# Altium schematic sheet ScaledModelBoard.SchDoc
size A; SheetNumber: 1; SheetTotal: 1
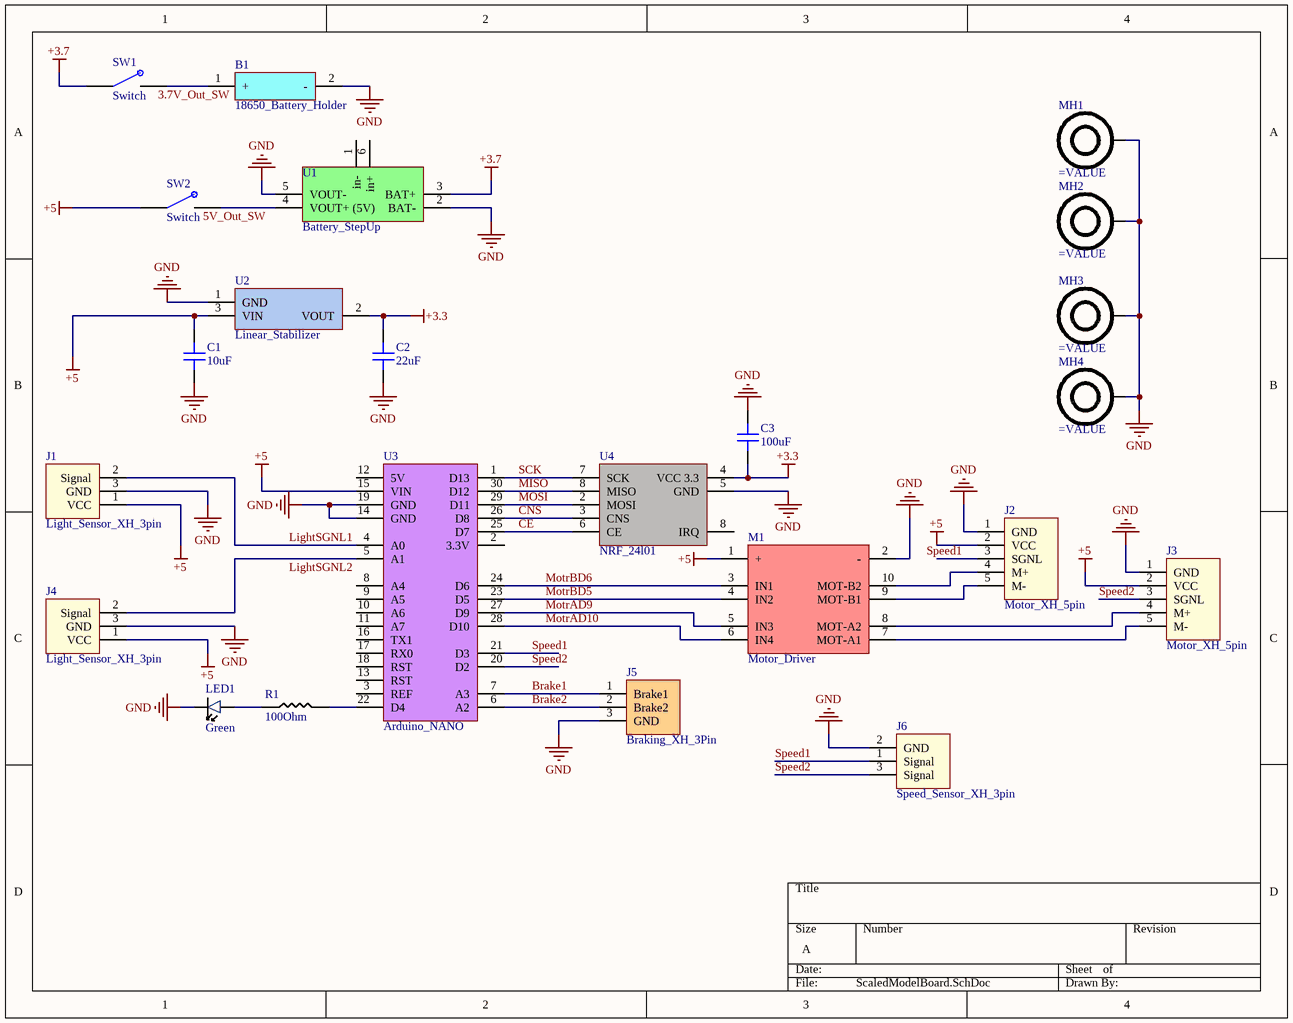
[diagram p0: ScaledModelBoard.SchDoc]

## Parts
B1  18650_Battery_Holder  [18650]
C1  10uF  [CAP 1206]
C2  22uF  [CAP 1206]
C3  100uF  [CAP 1206]
J1  Light_Sensor_XH_3pin  [JST XH B3B-XH-A]
J2  Motor_XH_5pin  [JST XH B5B-XH-A]
J3  Motor_XH_5pin  [JST XH B5B-XH-A]
J4  Light_Sensor_XH_3pin  [JST XH B3B-XH-A]
J5  Braking_XH_3Pin  [JST XH B3B-XH-A]
J6  Speed_Sensor_XH_3pin  [JST XH B3B-XH-A]
LED1  value Green  [LED_0603]  (hidden comment: 0603Gr)
M1  Motor_Driver  [Driver]
MH1  (no value)  [SCREW_M3.0]
MH2  (no value)  [SCREW_M3.0]
MH3  (no value)  [SCREW_M3.0]
MH4  (no value)  [SCREW_M3.0]
R1  100Ohm  [RES 0603]
SW1  Switch  [Switch]
SW2  Switch  [Switch]
U1  Battery_StepUp  [DC/DC]
U2  Linear_Stabilizer  [TO-220]
U3  Arduino_NANO  [MODULE_ABX00028]
U4  NRF_24l01  [NRF24L01]

## Nets
+3.3: C2.2 C3.1 U2.2(VOUT) U4.4(VCC_3.3)
+3.7: SW1.1 U1.3(BAT+)
+5: C1.2 J1.1(VCC) J2.2(VCC) J3.2(VCC) J4.1(VCC) M1.1(+) SW2.1 U2.3(VIN) U3.15(VIN)
GND: B1.2(-) C1.1 C2.1 C3.2 J1.3(GND) J2.1(GND) J3.1(GND) J4.3(GND) J5.3(GND) J6.2(GND) LED1.2 M1.2(-) MH1.1 MH2.1 MH3.1 MH4.1 U1.2(BAT-) U1.5(VOUT-) U2.1(GND) U3.14(GND) U3.19(GND) U4.5(GND)
3.7V_Out_SW: B1.1(+) SW1.2
5V_Out_SW: SW2.2 U1.4(VOUT+_(5V))
Brake1: J5.1(Brake1) U3.7(A3)
Brake2: J5.2(Brake2) U3.6(A2)
CE: U3.25(D7) U4.6(CE)
CNS: U3.26(D8) U4.3(CNS)
LightSGNL1: J1.2(Signal) U3.4(A0)
LightSGNL2: J4.2(Signal) U3.5(A1)
MISO: U3.30(D12) U4.8(IRQ)
MOSI: U3.29(D11) U4.2(MOSI)
MotrAD9: M1.5(IN3) U3.27(D9)
MotrAD10: M1.6(IN4) U3.28(D10)
MotrBD5: M1.4(IN2) U3.23(D5)
MotrBD6: M1.3(IN1) U3.24(D6)
SCK: U3.1(D13) U4.7(SCK)
Speed1: J2.3(SGNL) J6.1(Signal) U3.21(D3)
Speed2: J3.3(SGNL) J6.3(Signal) U3.20(D2)
NetJ2_4: J2.4(M+) M1.10(MOT-B2)
NetJ2_5: J2.5(M-) M1.9(MOT-B1)
NetJ3_4: J3.4(M+) M1.8(MOT-A2)
NetJ3_5: J3.5(M-) M1.7(MOT-A1)
NetLED1_1: LED1.1 R1.1
NetR1_2: R1.2 U3.22(D4)

Not connected (* = marked no-connect by the designer): U1 1(in-) 6(in+); U3 2(3.3V) 3(REF) 8(A4) 9(A5) 10(A6) 11(A7) 12(5V) 13(RST) 16(TX1) 17(RX0) 18(RST)

## Library data of the parts
C1-C3 = Capacitor: SMT Capacitor
  C1: Value: 10uF
  C2: Value: 22uF
  C3: Value: 100uF
LED1 = LED_GREEN_0603: LIGHT EMITTING DIODES (LED) GREEN 520~535NM 112~258MCD@20MA TOP VIEW 0603 ROHS; MFR Part #: 19-217/GHC-YR1S2/3T; Type: Basic; LCSC Part#: C72043
MH1-MH4 = SCREW
R1 = R_100Ohm_1206: 100Ω ±1% 0.25W ±100ppm/℃ 1206 Chip Resistor - Surface Mount RoHS; MFR Part #: 1206W4F1000T5E; LCSC Part#: C17901; Datasheet: https://datasheet.lcsc.com/lcsc/2206010145_UNI-ROYAL-Uniroyal-Elec-1206W4F1000T5E_C17901.pdf; Type: Basic; Value: 100Ohm